# Altium schematic sheet pwr.SchDoc
size A3; SheetNumber: 1; SheetTotal: 4
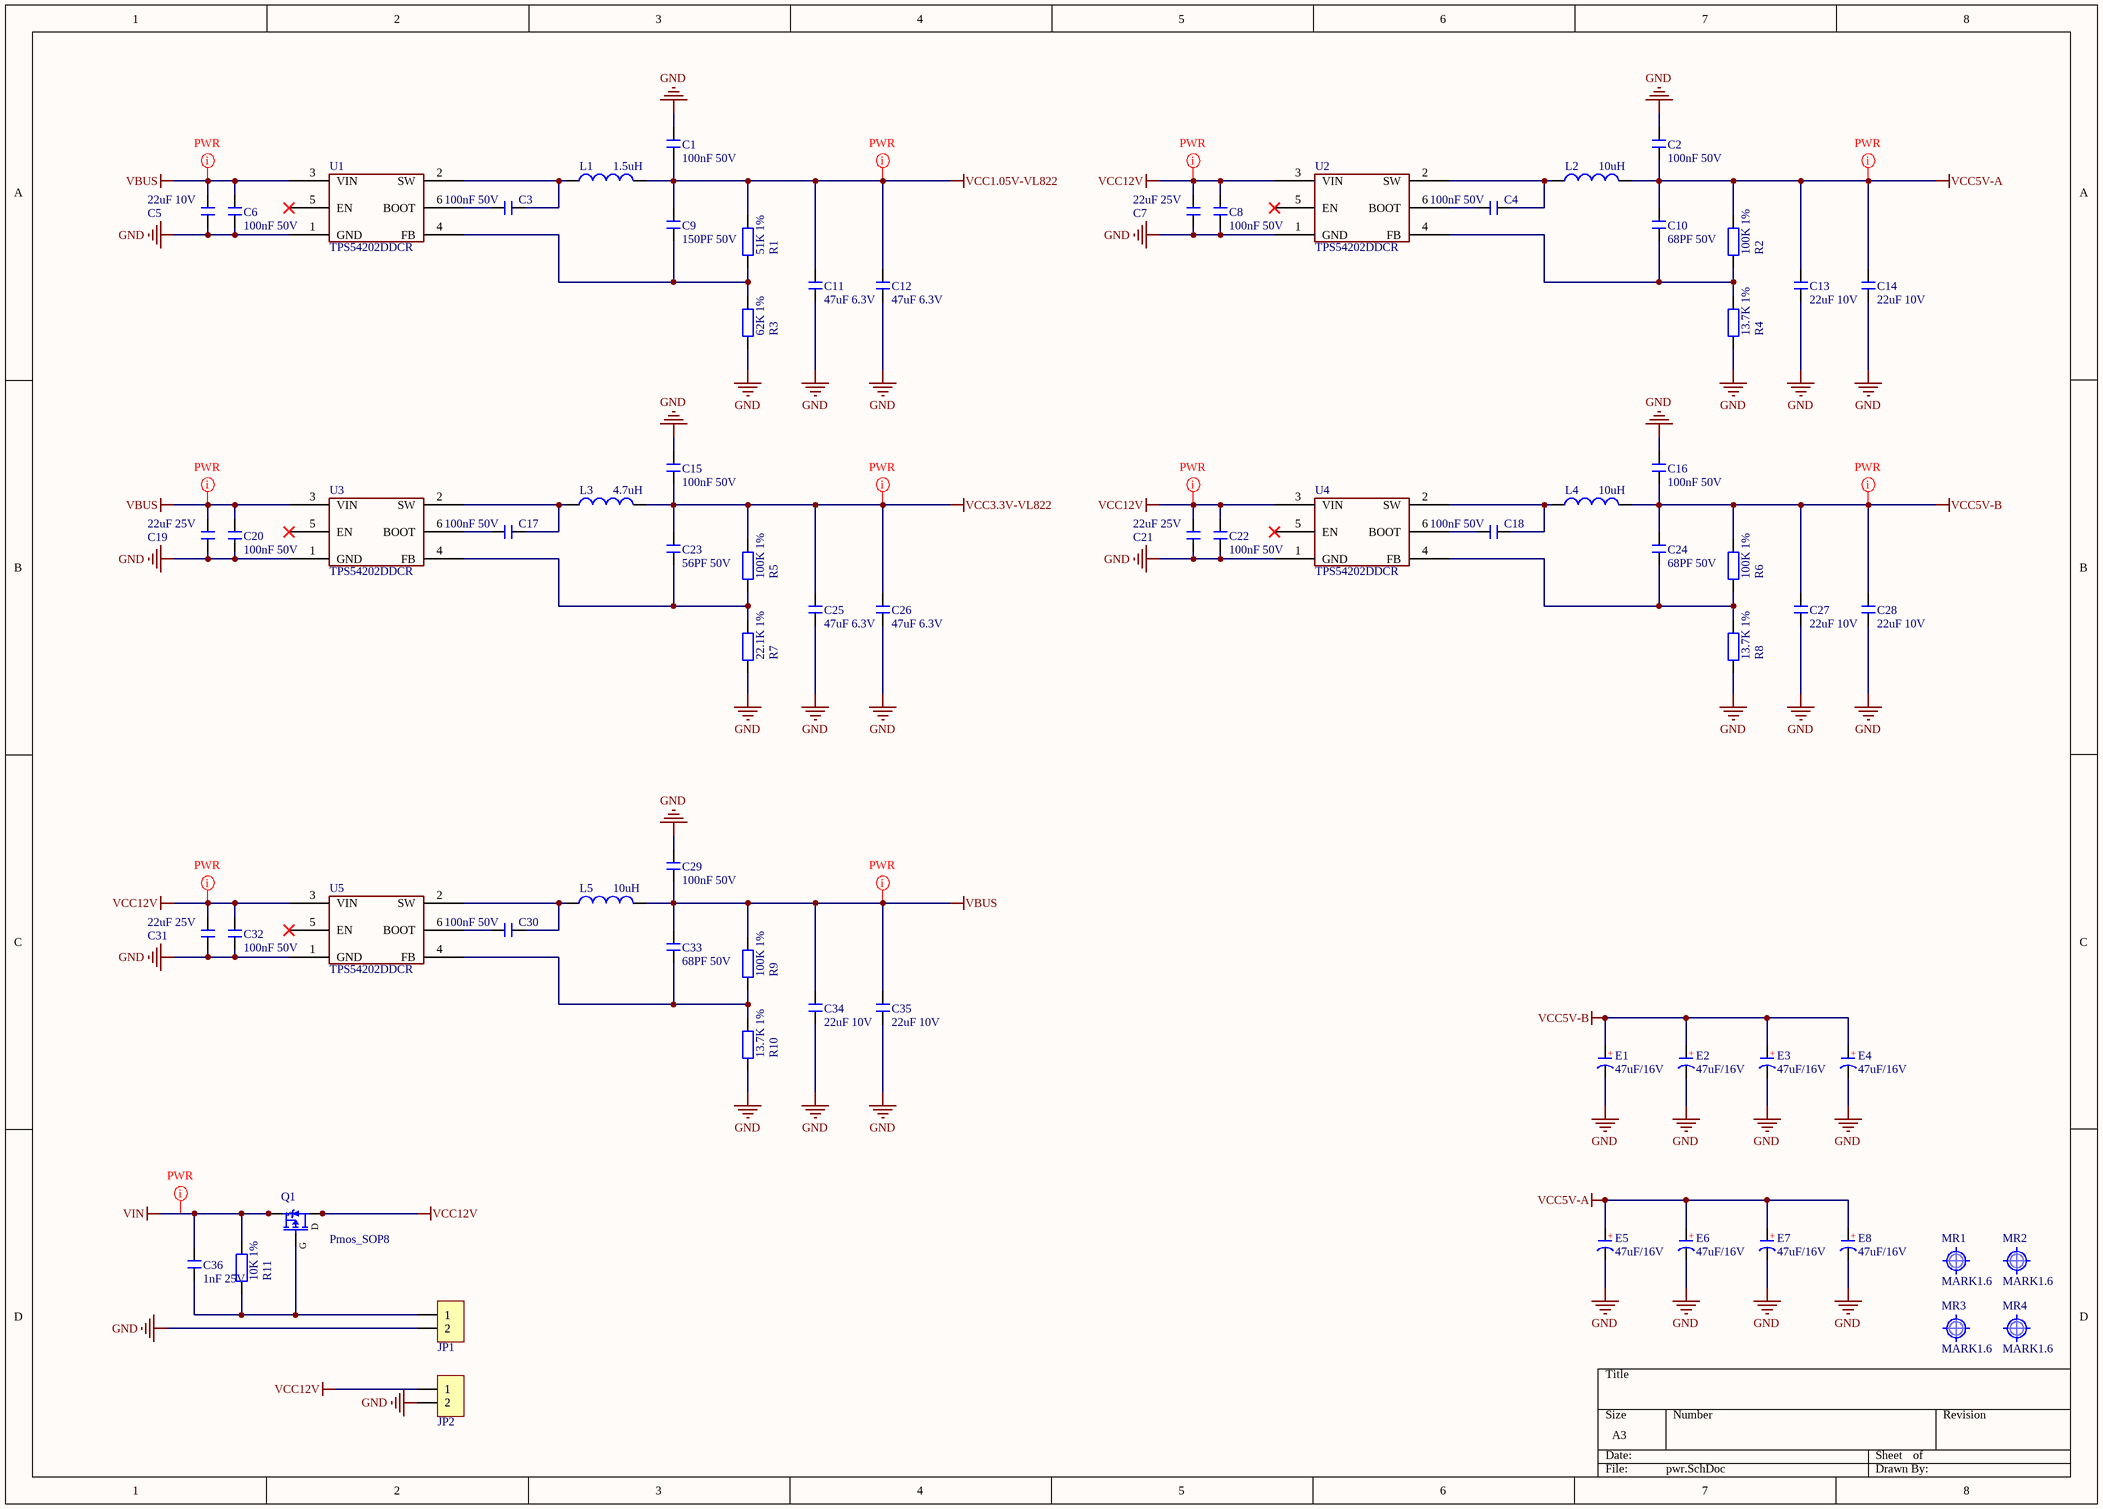
[diagram p0: pwr.SchDoc]

## Parts
C1  100nF 50V  [C0402_L]
C2  100nF 50V  [C0402_L]
C3  100nF 50V  [C0402_L]
C4  100nF 50V  [C0402_L]
C5  22uF 10V  [C0805_L]
C6  100nF 50V  [C0402_L]
C7  22uF 25V  [C0805_L]
C8  100nF 50V  [C0402_L]
C9  150PF 50V  [C0402_L]
C10  68PF 50V  [C0402_L]
C11  47uF 6.3V  [C0805_L]
C12  47uF 6.3V  [C0805_L]
C13  22uF 10V  [C0805_L]
C14  22uF 10V  [C0805_L]
C15  100nF 50V  [C0402_L]
C16  100nF 50V  [C0402_L]
C17  100nF 50V  [C0402_L]
C18  100nF 50V  [C0402_L]
C19  22uF 25V  [C0805_L]
C20  100nF 50V  [C0402_L]
C21  22uF 25V  [C0805_L]
C22  100nF 50V  [C0402_L]
C23  56PF 50V  [C0402_L]
C24  68PF 50V  [C0402_L]
C25  47uF 6.3V  [C0805_L]
C26  47uF 6.3V  [C0805_L]
C27  22uF 10V  [C0805_L]
C28  22uF 10V  [C0805_L]
C29  100nF 50V  [C0402_L]
C30  100nF 50V  [C0402_L]
C31  22uF 25V  [C0805_L]
C32  100nF 50V  [C0402_L]
C33  68PF 50V  [C0402_L]
C34  22uF 10V  [C0805_L]
C35  22uF 10V  [C0805_L]
C36  1nF 25V  [C0402_L]
E1  47uF/16V  [CS 6*4 - R]
E2  47uF/16V  [CS 6*4 - R]
E3  47uF/16V  [CS 6*4 - R]
E4  47uF/16V  [CS 6*4 - R]
E5  47uF/16V  [CS 6*4 - R]
E6  47uF/16V  [CS 6*4 - R]
E7  47uF/16V  [CS 6*4 - R]
E8  47uF/16V  [CS 6*4 - R]
JP1  HDR-1X2  [ZH1.5-WS-2P]  (value not drawn)
JP2  HDR-1X2  [XH2.54-WS-2P]  (value not drawn)
L1  1.5uH  [SMMS0420]
L2  10uH  [SMMS0420]
L3  4.7uH  [SMMS0420]
L4  10uH  [SMMS0420]
L5  10uH  [SMMS0420]
MR1  MARK1.6  [Mark 1]
MR2  MARK1.6  [Mark 1]
MR3  MARK1.6  [Mark 1]
MR4  MARK1.6  [Mark 1]
Q1  Pmos_SOP8  [SOP8_L]
R1  51K 1%  [R0402_L]
R2  100K 1%  [R0402_L]
R3  62K 1%  [R0402_L]
R4  13.7K 1%  [R0402_L]
R5  100K 1%  [R0402_L]
R6  100K 1%  [R0402_L]
R7  22.1K 1%  [R0402_L]
R8  13.7K 1%  [R0402_L]
R9  100K 1%  [R0402_L]
R10  13.7K 1%  [R0402_L]
R11  10K 1%  [R0402_L]
U1  TPS54202DDCR  [SOT23-6L]
U2  TPS54202DDCR  [SOT23-6L]
U3  TPS54202DDCR  [SOT23-6L]
U4  TPS54202DDCR  [SOT23-6L]
U5  TPS54202DDCR  [SOT23-6L]

## Nets
GND: C1.2 C2.2 C5.1 C6.1 C7.1 C8.1 C11.2 C12.2 C13.2 C14.2 C15.2 C16.2 C19.1 C20.1 C21.1 C22.1 C25.2 C26.2 C27.2 C28.2 C29.2 C31.1 C32.1 C34.2 C35.2 E1.2(K) E2.2(K) E3.2(K) E4.2(K) E5.2(K) E6.2(K) E7.2(K) E8.2(K) JP1.2 JP2.2 R3.2 R4.2 R7.2 R8.2 R10.2 U1.1(GND) U2.1(GND) U3.1(GND) U4.1(GND) U5.1(GND)
VBUS: C5.2 C6.2 C19.2 C20.2 C29.1 C33.2 C34.1 C35.1 L5.2 R9.1 U1.3(VIN) U3.3(VIN)
VCC1.05V-VL822: C1.1 C9.2 C11.1 C12.1 L1.2 R1.1
VCC3.3V-VL822: C15.1 C23.2 C25.1 C26.1 L3.2 R5.1
VCC5V-A: C2.1 C10.2 C13.1 C14.1 E5.1(A) E6.1(A) E7.1(A) E8.1(A) L2.2 R2.1
VCC5V-B: C16.1 C24.2 C27.1 C28.1 E1.1(A) E2.1(A) E3.1(A) E4.1(A) L4.2 R6.1
VCC12V: C7.2 C8.2 C21.2 C22.2 C31.2 C32.2 JP2.1 Q1.5(D) Q1.6(D) Q1.7(D) Q1.8(D) U2.3(VIN) U4.3(VIN) U5.3(VIN)
VIN: C36.1 Q1.1(S) Q1.2(S) Q1.3(S) R11.1
NetC3_1: C3.1 U1.6(BOOT)
NetC3_2: C3.2 L1.1 U1.2(SW)
NetC4_1: C4.1 U2.6(BOOT)
NetC4_2: C4.2 L2.1 U2.2(SW)
NetC9_1: C9.1 R1.2 R3.1 U1.4(FB)
NetC10_1: C10.1 R2.2 R4.1 U2.4(FB)
NetC17_1: C17.1 U3.6(BOOT)
NetC17_2: C17.2 L3.1 U3.2(SW)
NetC18_1: C18.1 U4.6(BOOT)
NetC18_2: C18.2 L4.1 U4.2(SW)
NetC23_1: C23.1 R5.2 R7.1 U3.4(FB)
NetC24_1: C24.1 R6.2 R8.1 U4.4(FB)
NetC30_1: C30.1 U5.6(BOOT)
NetC30_2: C30.2 L5.1 U5.2(SW)
NetC33_1: C33.1 R9.2 R10.1 U5.4(FB)
NetC36_2: C36.2 JP1.1 Q1.4(G) R11.2

Not connected (* = marked no-connect by the designer): U1 5(EN)*; U2 5(EN)*; U3 5(EN)*; U4 5(EN)*; U5 5(EN)*

## Layout directives
net class PWR: VBUS, VCC1.05V-VL822, VCC3.3V-VL822, VCC5V-A, VCC5V-B, VCC12V, VIN

## Notes on the sheet
- (in symbol C-CD) +

## Library data of the parts
C1-C36 = C: 无极性贴片电容; 版权归属: 源创客; 材质: X7R; BOM名称: 无极性贴片电容; 学习资源: www.ooocke.com
E1-E8 = C-CD: 贴片电解电容; BOM名称: 贴片钽电容; 版权归属: 源创客; 学习资源: www.ooocke.com
JP1 JP2 = Header 2: 2P接插件; 版权归属: 源创客; BOM名称: 2P接插件; 学习资源: www.ooocke.com
L1-L5 = L: 小功率贴片电感; 版权归属: 源创客; BOM名称: 小功率贴片电感; 学习资源: www.ooocke.com
MR1-MR4 = MARK: 光学定位点; 版权归属: 源创客; BOM名称: 光学定位点; 学习资源: www.ooocke.com
Q1 = Pmos_SOP8: BOM名称: 场效应管; 版权归属: 源创客; 描述: P沟道 30V/4.2A; 学习资源: www.ooocke.com
R1-R11 = R: 贴片电阻; 版权归属: 源创客; BOM名称: 贴片电阻; 学习资源: www.ooocke.com
U1-U5 = TPS54202DDCR: DCDC Convert